# EAGLE schematic mainboardv3.1-clone (EAGLE 9.4.2)
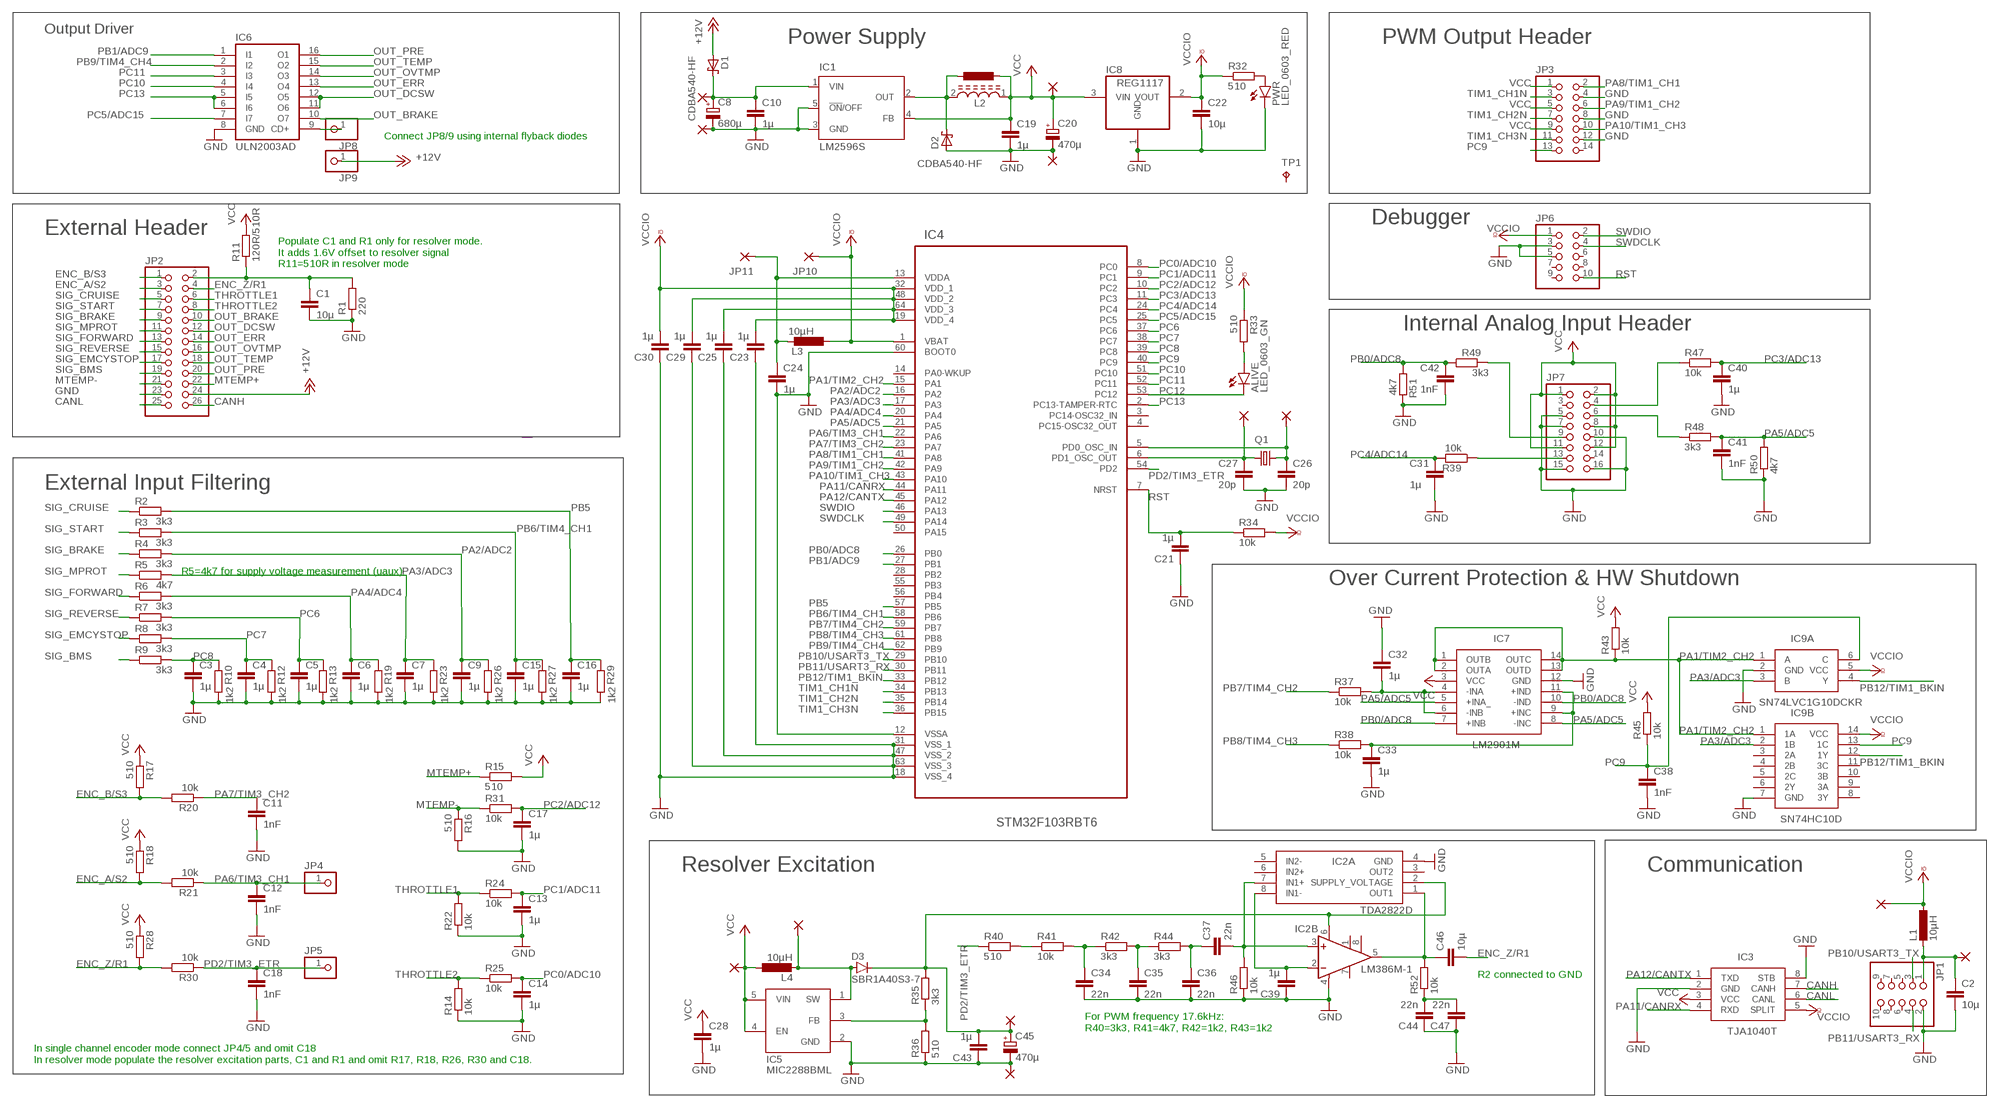
[diagram p0: schematic, sheet 1]

## Parts
ALIVE  LED_0603_GN  LEDSML0805  [SML0805]
C1  10µ  C-EUC0805K  [C0805K]
C2  10µ  C-EUC0805K  [C0805K]
C3  1µ  C-EUC0603K  [C0603K]
C4  1µ  C-EUC0603K  [C0603K]
C5  1µ  C-EUC0603K  [C0603K]
C6  1µ  C-EUC0603K  [C0603K]
C7  1µ  C-EUC0603K  [C0603K]
C8  680µ  CPOL-EU153CLV-1014  [153CLV-1014]
C9  1µ  C-EUC0603K  [C0603K]
C10  1µ  C-EUC0603K  [C0603K]
C11  1nF  C-EUC0603K  [C0603K]
C12  1nF  C-EUC0603K  [C0603K]
C13  1µ  C-EUC0603K  [C0603K]
C14  1µ  C-EUC0603K  [C0603K]
C15  1µ  C-EUC0603K  [C0603K]
C16  1µ  C-EUC0603K  [C0603K]
C17  1µ  C-EUC0603K  [C0603K]
C18  1nF  C-EUC0603K  [C0603K]
C19  1µ  C-EUC0603K  [C0603K]
C20  470µ  CPOL-EU153CLV-0605  [153CLV-0605]
C21  1µ  C-EUC0603K  [C0603K]
C22  10µ  C-EUC0805K  [C0805K]
C23  1µ  C-EUC0603K  [C0603K]
C24  1µ  C-EUC0603K  [C0603K]
C25  1µ  C-EUC0603K  [C0603K]
C26  20p  C-EUC0603K  [C0603K]
C27  20p  C-EUC0603K  [C0603K]
C28  1µ  C-EUC0603K  [C0603K]
C29  1µ  C-EUC0603K  [C0603K]
C30  1µ  C-EUC0603K  [C0603K]
C31  1µ  C-EUC0603K  [C0603K]
C32  1µ  C-EUC0603K  [C0603K]
C33  1µ  C-EUC0603K  [C0603K]
C34  22n  C-EUC0603K  [C0603K]
C35  22n  C-EUC0603K  [C0603K]
C36  22n  C-EUC0603K  [C0603K]
C37  22n  C-EUC0603K  [C0603K]
C38  1nF  C-EUC0603K  [C0603K]
C39  1µ  C-EUC0603K  [C0603K]
C40  1µ  C-EUC0603K  [C0603K]
C41  1nF  C-EUC0603K  [C0603K]
C42  1nF  C-EUC0603K  [C0603K]
C43  1µ  C-EUC0603K  [C0603K]
C44  22n  C-EUC0603K  [C0603K]
C45  470µ  CPOL-EU153CLV-0605  [153CLV-0605]
C46  10µ  C-EUC0805K  [C0805K]
C47  22n  C-EUC0603K  [C0603K]
D1  CDBA540-HF  SCHOTTKY-DIODESMD  [SMB]
D2  CDBA540-HF  SCHOTTKY-DIODESMD  [SMB]
D3  SBR1A40S3-7  D-SOD123  [SOD123]
IC1  LM2596S  [TO263-5]
IC2A  TDA2822D  [SOIC127P600X175-8N]
IC2B  LM386M-1  [SO08]
IC3  TJA1040T  [SOIC127P600X175-8N]
IC4  STM32F103RBT6  [QFP50P1200X1200X160-64N]
IC5  MIC2288BML  [SOT23-5L]
IC6  ULN2003AD  [SO16]
IC7  LM2901M  [SOP127P600X180-14N]
IC8  REG1117  [SOT223]
IC9A  SN74LVC1G10DCKR  [SOT65P210X110-6N]
IC9B  SN74HC10D  [SOIC127P600X175-14N]
JP1  PINHD-2X5/90  [2X05/90]
JP2  PINHD-2X13  [2X13]
JP3  PINHD-2X7  [2X07]
JP4  PINHD-1X1  [1X01]
JP5  PINHD-1X1  [1X01]
JP6  PINHD-2X5  [2X05]
JP7  PINHD-2X8  [2X08]
JP8  PINHD-1X1  [1X01]
JP9  PINHD-1X1  [1X01]
JP10  1,6/0,9  [1,6/0,9]
JP11  1,6/0,9  [1,6/0,9]
JP12  1,6/0,8  [1,6/0,8]
JP13  1,6/0,8  [1,6/0,8]
JP14  1,6/0,8  [1,6/0,8]
JP15  1,6/0,8  [1,6/0,8]
JP16  1,6/0,8  [1,6/0,8]
JP17  1,6/0,8  [1,6/0,8]
L1  10µH  L-EUL3225M  [L3225M]
L2  SRR1260-471K  [INDP125125X600N]
L3  10µH  L-EUL3225M  [L3225M]
L4  10µH  L-EUL3225M  [L3225M]
L5  L-EUTJ3-U1  [TJ3-U1]
PAD1  1,6/0,9  [1,6/0,9]
PAD2  1,6/0,9  [1,6/0,9]
PAD3  1,6/0,8  [1,6/0,8]
PAD4  1,6/0,8  [1,6/0,8]
PAD5  1,6/0,8  [1,6/0,8]
PAD6  1,6/0,8  [1,6/0,8]
PWR  LED_0603_RED  LEDSML0805  [SML0805]
Q1  CSM-7X-DU  [CSM-7X-DU]
R1  220  R-EU_R0603  [R0603]
R2  3k3  R-EU_R0603  [R0603]
R3  3k3  R-EU_R0603  [R0603]
R4  3k3  R-EU_R0603  [R0603]
R5  4k7  R-EU_R0603  [R0603]
R6  3k3  R-EU_R0603  [R0603]
R7  3k3  R-EU_R0603  [R0603]
R8  3k3  R-EU_R0603  [R0603]
R9  3k3  R-EU_R0603  [R0603]
R10  1k2  R-EU_R0603  [R0603]
R11  120R/510R  R-EU_R0603  [R0603]
R12  1k2  R-EU_R0603  [R0603]
R13  1k2  R-EU_R0603  [R0603]
R14  10k  R-EU_R0603  [R0603]
R15  510  R-EU_R0603  [R0603]
R16  510  R-EU_R0603  [R0603]
R17  510  R-EU_R0603  [R0603]
R18  510  R-EU_R0603  [R0603]
R19  1k2  R-EU_R0603  [R0603]
R20  10k  R-EU_R0603  [R0603]
R21  10k  R-EU_R0603  [R0603]
R22  10k  R-EU_R0603  [R0603]
R23  1k2  R-EU_R0603  [R0603]
R24  10k  R-EU_R0603  [R0603]
R25  10k  R-EU_R0603  [R0603]
R26  1k2  R-EU_R0603  [R0603]
R27  1k2  R-EU_R0603  [R0603]
R28  510  R-EU_R0603  [R0603]
R29  1k2  R-EU_R0603  [R0603]
R30  10k  R-EU_R0603  [R0603]
R31  10k  R-EU_R0603  [R0603]
R32  510  R-EU_R0603  [R0603]
R33  510  R-EU_R0603  [R0603]
R34  10k  R-EU_R0603  [R0603]
R35  3k3  R-EU_R0603  [R0603]
R36  510  R-EU_R0603  [R0603]
R37  10k  R-EU_R0603  [R0603]
R38  10k  R-EU_R0603  [R0603]
R39  10k  R-EU_R0603  [R0603]
R40  510  R-EU_R0603  [R0603]
R41  10k  R-EU_R0603  [R0603]
R42  3k3  R-EU_R0603  [R0603]
R43  10k  R-EU_R0603  [R0603]
R44  3k3  R-EU_R0603  [R0603]
R45  10k  R-EU_R0603  [R0603]
R46  10k  R-EU_R0603  [R0603]
R47  10k  R-EU_R0603  [R0603]
R48  3k3  R-EU_R0603  [R0603]
R49  3k3  R-EU_R0603  [R0603]
R50  4k7  R-EU_R0603  [R0603]
R51  4k7  R-EU_R0603  [R0603]
R52  10k  R-EU_R0603  [R0603]
TP1  TPB1,27  [B1,27]

## Nets
+12V: D1.A JP2.24 JP9.1
CANH: IC3.7(CANH) JP2.26
CANL: IC3.6(CANL) JP2.25
ENC_A/S2: JP2.3 R18.2 R21.2
ENC_B/S3: JP2.1 R17.2 R20.2
ENC_Z/R1: C46.2 JP2.4 R28.2 R30.2
GND: C1.2 C2.2 C3.2 C4.2 C5.2 C6.2 C7.2 C8.- C9.2 C10.2 C11.2 C12.2 C13.2 C14.2 C15.2 C16.2 C17.2 C18.2 C19.2 C20.- C21.1 C22.2 C23.1 C24.2 C25.1 C26.2 C27.2 C28.2 C29.1 C30.1 C31.2 C32.1 C33.2 C34.2 C35.2 C36.2 C38.2 C39.1 C40.2 C41.2 C42.2 C43.1 C44.1 C45.- C47.1 D2.A IC1.3(GND) IC1.5(!ON!/OFF) IC2A.4(GND) IC2B.4(GND) IC3.2(GND) IC3.8(STB) IC4.12(VSSA) IC4.18(VSS_4) IC4.31(VSS_1) IC4.47(VSS_2) IC4.60(BOOT0) IC4.63(VSS_3) IC5.2(GND) IC6.8(GND) IC7.12(GND) IC8.1(GND) IC9A.2(GND) IC9B.7(GND) JP1.2 JP2.23 JP3.4 JP3.8 JP3.12 JP6.3 JP6.5 JP7.5 JP7.7 JP7.10 JP7.15 JP7.16 PAD1.1(P) PAD3.1(P) PAD6.1(P) PWR.C R1.1 R10.2 R12.2 R13.2 R14.1 R16.2 R19.2 R22.1 R23.2 R26.2 R27.2 R29.2 R36.1 R46.1 R50.1 R51.2
MTEMP+: JP2.22 R15.1
MTEMP-: JP2.21 R16.1 R31.1
N$1: C1.1 JP2.2 R1.2 R11.1
N$2: ALIVE.A R33.2
N$3: D2.C IC1.2(OUT) L2.2 L5.1
N$4: C8.+ C10.1 D1.C IC1.1(VIN) PAD2.1(P)
N$5: PWR.A R32.2
N$7: C27.1 IC4.6(PD1_OSC_OUT) JP17.1(P) Q1.1
N$8: C24.1 IC4.13(VDDA) JP11.1(P) L3.1
N$9: IC6.9(CD+) JP8.1
N$10: JP7.9 R49.2
N$11: JP7.13 R39.1
N$12: JP7.4 R47.1
N$13: JP7.6 R48.1
N$14: C32.2 IC7.4(-INA) IC7.6(-INB) R37.2
N$15: C33.1 IC7.9(+INC) IC7.11(+IND) R38.2
N$16: D3.2(A) IC5.1(SW) JP13.1(P) L4.2
N$17: IC5.3(FB) R35.1 R36.2
N$18: C43.2 C45.+ D3.1(C) IC2A.2(SUPPLY_VOLTAGE) IC2B.6(VS) PAD5.1(P) R35.2
N$19: R40.2 R41.1
N$20: C34.1 R41.2 R42.1
N$21: C35.1 R42.2 R44.1
N$22: C36.1 C37.1 R44.2
N$23: C39.2 IC2A.8(IN1-) IC2B.2(-IN)
N$24: C37.2 IC2A.7(IN1+) IC2B.3(+IN) R46.2
N$25: C44.2 C47.2 R52.1
N$26: C46.1 IC2A.1(OUT1) IC2B.5(OUT) R52.2
N$27: C2.1 JP1.1 JP15.1(P) L1.2
N$28: C26.1 IC4.5(PD0_OSC_IN) JP16.1(P) Q1.2
OUT_BRAKE: IC6.10(O7) JP2.10
OUT_DCSW: IC6.11(O6) IC6.12(O5) JP2.12
OUT_ERR: IC6.13(O4) JP2.14
OUT_OVTMP: IC6.14(O3) JP2.16
OUT_PRE: IC6.16(O1) JP2.20
OUT_TEMP: IC6.15(O2) JP2.18
PA1/TIM2_CH2: IC4.15(PA1) IC7.1(OUTB) IC7.2(OUTA) IC7.13(OUTD) IC7.14(OUTC) IC9A.1(A) IC9B.1(1A) R43.1
PA2/ADC2: C9.1 IC4.16(PA2) R4.2 R26.1
PA3/ADC3: C7.1 IC4.17(PA3) IC9A.3(B) IC9B.2(1B) R5.2 R23.1
PA4/ADC4: C6.1 IC4.20(PA4) R6.2 R19.1
PA5/ADC5: C41.1 IC4.21(PA5) IC7.5(+INA_) IC7.8(-INC) R48.2 R50.2
PA6/TIM3_CH1: C12.1 IC4.22(PA6) JP4.1 R21.1
PA7/TIM3_CH2: C11.1 IC4.23(PA7) R20.1
PA8/TIM1_CH1: IC4.41(PA8) JP3.2
PA9/TIM1_CH2: IC4.42(PA9) JP3.6
PA10/TIM1_CH3: IC4.43(PA10) JP3.10
PA11/CANRX: IC3.4(RXD) IC4.44(PA11)
PA12/CANTX: IC3.1(TXD) IC4.45(PA12)
PB0/ADC8: C42.1 IC4.26(PB0) IC7.7(+INB) IC7.10(-IND) R49.1 R51.1
PB1/ADC9: IC4.27(PB1) IC6.1(I1)
PB5: C16.1 IC4.57(PB5) R2.2 R29.1
PB6/TIM4_CH1: C15.1 IC4.58(PB6) R3.2 R27.1
PB7/TIM4_CH2: IC4.59(PB7) R37.1
PB8/TIM4_CH3: IC4.61(PB8) R38.1
PB9/TIM4_CH4: IC4.62(PB9) IC6.2(I2)
PB10/USART3_TX: IC4.29(PB10) JP1.3
PB11/USART3_RX: IC4.30(PB11) JP1.4
PB12/TIM1_BKIN: IC4.33(PB12) IC9A.4(Y) IC9B.12(1Y)
PC0/ADC10: C14.1 IC4.8(PC0) R25.2
PC1/ADC11: C13.1 IC4.9(PC1) R24.2
PC2/ADC12: C17.1 IC4.10(PC2) R31.2
PC3/ADC13: C40.1 IC4.11(PC3) R47.2
PC4/ADC14: C31.1 IC4.24(PC4) R39.2
PC5/ADC15: IC4.25(PC5) IC6.7(I7)
PC6: C5.1 IC4.37(PC6) R7.2 R13.1
PC7: C4.1 IC4.38(PC7) R8.2 R12.1
PC8: C3.1 IC4.39(PC8) R9.2 R10.1
PC9: C38.1 IC4.40(PC9) IC9A.6(C) IC9B.13(1C) JP3.13 R45.1
PC10: IC4.51(PC10) IC6.4(I4)
PC11: IC4.52(PC11) IC6.3(I3)
PC12: ALIVE.C IC4.53(PC12)
PC13: IC4.2(PC13-TAMPER-RTC) IC6.5(I5) IC6.6(I6)
PD2/TIM3_ETR: C18.1 IC4.54(PD2) JP5.1 R30.1 R40.1
RST: C21.2 IC4.7(NRST) JP6.10 R34.1
SIG_BMS: JP2.19 R9.1
SIG_BRAKE: JP2.9 R4.1
SIG_CRUISE: JP2.5 R2.1
SIG_EMCYSTOP: JP2.17 R8.1
SIG_FORWARD: JP2.13 R6.1
SIG_MPROT: JP2.11 R5.1
SIG_REVERSE: JP2.15 R7.1
SIG_START: JP2.7 R3.1
SWDCLK: IC4.49(PA14) JP6.4
SWDIO: IC4.46(PA13) JP6.2
THROTTLE1: JP2.6 R22.2 R24.1
THROTTLE2: JP2.8 R14.2 R25.1
TIM1_CH1N: IC4.34(PB13) JP3.3
TIM1_CH2N: IC4.35(PB14) JP3.7
TIM1_CH3N: IC4.36(PB15) JP3.11
VCC: C19.1 C20.+ C28.1 IC1.4(FB) IC3.3(VCC) IC5.4(EN) IC5.5(VIN) IC7.3(VCC) IC8.3(VIN) JP3.1 JP3.5 JP3.9 JP7.1 JP7.2 JP7.8 JP7.11 JP7.12 JP12.1(P) L2.1 L4.1 L5.2 PAD4.1(P) R11.2 R15.2 R17.1 R18.1 R28.1 R43.2 R45.2
VCCIO: C22.1 C23.2 C25.2 C29.2 C30.2 IC3.5(SPLIT) IC4.1(VBAT) IC4.19(VDD_4) IC4.32(VDD_1) IC4.48(VDD_2) IC4.64(VDD_3) IC8.2(VOUT) IC9A.5(VCC) IC9B.14(VCC) JP6.1 JP10.1(P) JP14.1(P) L1.1 L3.2 R32.1 R33.1 R34.2
Unconnected: IC2A.3(OUT2) IC2A.5(IN2-) IC2A.6(IN2+) IC2B.1(GAIN) IC2B.7(BYPASS) IC2B.8(GAIN) IC4.3(PC14-OSC32_IN) IC4.4(PC15-OSC32_OUT) IC4.14(PA0-WKUP) IC4.28(PB2) IC4.50(PA15) IC4.55(PB3) IC4.56(PB4) IC9B.3(2A) IC9B.4(2B) IC9B.5(2C) IC9B.6(2Y) IC9B.8(3Y) IC9B.9(3A) IC9B.10(3B) IC9B.11(3C) JP1.5 JP1.6 JP1.7 JP1.8 JP1.9 JP1.10 JP3.14 JP6.6 JP6.7 JP6.8 JP6.9 JP7.3 JP7.14 TP1.TP

## Notes on the sheet
- Output Driver
- Power Supply | PWM Output Header
- Connect JP8/9 using internal flyback diodes
- Debugger
- External Header
- Populate C1 and R1 only for resolver mode.
  It adds 1.6V offset to resolver signal
  R11=510R in resolver mode
- Internal Analog Input Header
- External Input Filtering
- R5=4k7 for supply voltage measurement (uaux)
- Over Current Protection & HW Shutdown
- Resolver Excitation | Communication
- R2 connected to GND
- For PWM frequency 17.6kHz:
  R40=3k3, R41=4k7, R42=1k2, R43=1k2
- In single channel encoder mode connect JP4/5 and omit C18
  In resolver mode populate the resolver excitation parts, C1 and R1 and omit R17, R18, R26, R30 and C18.

## Library data of the parts
ALIVE PWR = led:LED: LED OSRAM: - CHIPLED LG R971, LG N971, LY N971, LG Q971, LY Q971, LO R971, LY R971 LH N974, LH R974 LS Q976, LO Q976, LY Q976 LO Q996 - Hyper CHIPLED LW Q18S LB Q993, LB Q99A, LB R99A - SideLED LS A670, LO A670, LY A670, LG A670, LP A670 LB A673, LV A673, LT A673, LW A673 LH A674 LY A675 LS A676, LA A676, LO A676, LY A676, LW A676 LS A679, LY A679, LG A679 - Hyper Micro SIDELED® LS Y876, LA Y876, LO Y876, LY Y876 LT Y87S - SmartLED LW L88C, LW L88S LB L89C, LB L89S, LG L890 LS L89K, LO L89K, LY L89K LS L896, LA L896, LO L896, LY L896 - TOPLED LS T670, LO T670, LY T670, LG T670, LP T670 LSG T670, LSP T670, LSY T670, LOP T670, LYG T670 LG T671, LOG T671, LSG T671 LB T673, LV T673, LT T673, LW T673 LH T674 LS T676, LA T676, LO T676, LY T676, LB T676, LH T676, LSB T676, LW T676 LB T67C, LV T67C, LT T67C, LS T67K, LO T67K, LY T67K, LW E67C LS E67B, LA E67B, LO E67B, LY E67B, LB E67C, LV E67C, LT E67C LW T67C LS T679, LY T679, LG T679 LS T770, LO T770, LY T770, LG T770, LP T770 LB T773, LV T773, LT T773, LW T773 LH T774 LS E675, LA E675, LY E675, LS T675 LS T776, LA T776, LO T776, LY T776, LB T776 LHGB T686 LT T68C, LB T68C - Hyper Mini TOPLED® LB M676 - Mini TOPLED Santana® LG M470 LS M47K, LO M47K, LY M47K Source: http://www.osram.convergy.de LUXEON: - LUMILED® LXK2-PW12-R00, LXK2-PW12-S00, LXK2-PW14-U00, LXK2-PW14-V00 LXK2-PM12-R00, LXK2-PM12-S00, LXK2-PM14-U00 LXK2-PE12-Q00, LXK2-PE12-R00, LXK2-PE12-S00, LXK2-PE14-T00, LXK2-PE14-U00 LXK2-PB12-K00, LXK2-PB12-L00, LXK2-PB12-M00, LXK2-PB14-N00, LXK2-PB14-P00, LXK2-PB14-Q00 LXK2-PR12-L00, LXK2-PR12-M00, LXK2-PR14-Q00, LXK2-PR14-R00 LXK2-PD12-Q00, LXK2-PD12-R00, LXK2-PD12-S00 LXK2-PH12-R00, LXK2-PH12-S00 LXK2-PL12-P00, LXK2-PL12-Q00, LXK2-PL12-R00 Source: www.luxeon.com KINGBRIGHT: KA-3528ASYC Source: www.kingbright.com
C1-C7 C9-C19 C21-C44 C46 C47 = resistor:C-EU: CAPACITOR, European symbol
C8 C20 C45 = resistor:CPOL-EU: POLARIZED CAPACITOR, European symbol
D1 D2 = diode:SCHOTTKY-DIODE: Schottky Diode
D3 = semicon-smd-ipc:D-: DIODE unfilled
IC1 = national-semiconductor:LM2596: SIMPLE SWITCHER® Power Converter 150 kHz 3A Step-Down Voltage Regulator Source: http://www.national.com/ds/LM/LM2596.pdf; MF: NATIONAL SEMICONDUCTOR; MPN: LM2596S-ADJ/NOPB; OC_FARNELL: 9494367; OC_NEWARK: 41K3842
IC2A = SamacSys_Parts:TDA2822D: Quadmm TDA2822D, Audio Amplifier Class-AB mono/stereo +150C 8-Pin SOIC Source: Datasheet <http://docs-emea.rs-online.com/webdocs/0acf/0900766b80acf19c.pdf>; ALLIED_NUMBER: 70391772; ALLIED_PRICE-STOCK: http://www.alliedelec.com/stmicroelectronics-tda2822d/70391772/; DESCRIPTION: Quadmm TDA2822D, Audio Amplifier Class-AB mono/stereo +150C 8-Pin SOIC; HEIGHT: 1.75mm; MANUFACTURER_NAME: STMicroelectronics; MANUFACTURER_PART_NUMBER: TDA2822D; MOUSER_PART_NUMBER: 511-TDA2822D; MOUSER_PRICE-STOCK: https://www.mouser.com/Search/Refine.aspx?Keyword=511-TDA2822D; RS_PART_NUMBER: 0426162P; RS_PRICE-STOCK: http://uk.rs-online.com/web/p/products/0426162P
IC2B = linear:LM386?-*: Low Voltage Audio Power Amplifier Source: http://cache.national.com/ds/LM/LM386.pdf
IC3 = SamacSys_Parts:TJA1040T: NXP TJA1040T, CAN Transceiver 1MBd 1-channel ISO 11898, 8-Pin SOIC Source: Datasheet <https://docs-emea.rs-online.com/webdocs/0425/0900766b804252fe.pdf>; DESCRIPTION: NXP TJA1040T, CAN Transceiver 1MBd 1-channel ISO 11898, 8-Pin SOIC; HEIGHT: 1.75mm; MANUFACTURER_NAME: NXP; MANUFACTURER_PART_NUMBER: TJA1040T; MOUSER_PART_NUMBER: 4837547; MOUSER_PRICE-STOCK: http://uk.rs-online.com/web/p/products/4837547; RS_PART_NUMBER: 4837547; RS_PRICE-STOCK: http://uk.rs-online.com/web/p/products/4837547
IC4 = STM32F103RBT6:STM32F103RBT6: 32BIT MCU; DESCRIPTION: Mainstream Performance line, ARM Cortex-M3 MCU with 128 Kbytes Flash, 72 MHz CPU, motor control, USB and CAN; DIGI-KEY_PART_NUMBER: 497-6066-ND; DIGI-KEY_PURCHASE_URL: https://www.digikey.ca/product-detail/en/stmicroelectronics/STM32F103RBT6/497-6066-ND/1646341?utm_source=snapeda&utm_medium=aggregator&utm_campaign=symbol; MF: STMicroelectronics; MP: STM32F103RBT6; PACKAGE: LQFP-64 STMicroelectronics
IC5 = MIC2288:MIC2288BML: Boost 3V-4.2V input to adjustable output (Micrel)
IC6 = uln-udn:ULN2003A: DRIVER ARRAY
IC7 = SamacSys_Parts:LM2901M: IC COMPARATOR QUAD VOLT Source: Datasheet <http://www.ti.com/lit/ds/symlink/lm2901-n.pdf>; DESCRIPTION: IC COMPARATOR QUAD VOLT; HEIGHT: mm; MANUFACTURER_NAME: National Semiconductor; MANUFACTURER_PART_NUMBER: LM2901M; MOUSER_PART_NUMBER: 4716204; MOUSER_PRICE-STOCK: http://uk.rs-online.com/web/p/products/4716204; RS_PART_NUMBER: 4716204; RS_PRICE-STOCK: http://uk.rs-online.com/web/p/products/4716204
IC8 = burr-brown:REG1117: 800mA and 1A Low Dropout (LDO) Positive Regulator 1.8V, 2.5V, 2.85V, 3.3V, 5V, and Adj; MPN: REG1117; OC_FARNELL: 1097566; OC_NEWARK: 14P6981
IC9A = SamacSys_Parts:SN74LVC1G10DCKR: Texas Instruments SN74LVC1G10DCKR, NAND 3 Input NAND, 1.65 5.5 V, 6-Pin SC-70 Source: Datasheet <http://www.ti.com/general/docs/lit/getliterature.tsp?genericPartNumber=SN74LVC1G10&&fileType=pdf>; DESCRIPTION: Texas Instruments SN74LVC1G10DCKR, NAND 3 Input NAND, 1.65 5.5 V, 6-Pin SC-70; HEIGHT: 1.1mm; MANUFACTURER_NAME: Texas Instruments; MANUFACTURER_PART_NUMBER: SN74LVC1G10DCKR; MOUSER_PART_NUMBER: 595-SN74LVC1G10DCKR; MOUSER_PRICE-STOCK: https://www.mouser.com/Search/Refine.aspx?Keyword=595-SN74LVC1G10DCKR; RS_PART_NUMBER: 1627462; RS_PRICE-STOCK: http://uk.rs-online.com/web/p/products/1627462
IC9B = SamacSys_Parts:SN74HC10D: Triple 3-Input Positive-NAND Gates Source: Datasheet <http://www.ti.com/lit/ds/symlink/sn74hc10.pdf>; DESCRIPTION: Triple 3-Input Positive-NAND Gates; HEIGHT: 1.75mm; MANUFACTURER_NAME: Texas Instruments; MANUFACTURER_PART_NUMBER: SN74HC10D; MOUSER_PART_NUMBER: 595-SN74HC10D; MOUSER_PRICE-STOCK: https://www.mouser.com/Search/Refine.aspx?Keyword=595-SN74HC10D; RS_PART_NUMBER: 6631896P; RS_PRICE-STOCK: http://uk.rs-online.com/web/p/products/6631896P
JP1 JP6 = pinhead:PINHD-2X5: PIN HEADER
JP2 = pinhead:PINHD-2X13: PIN HEADER
JP3 = pinhead:PINHD-2X7: PIN HEADER
JP4 JP5 JP8 JP9 = pinhead:PINHD-1X1: PIN HEADER
JP7 = pinhead:PINHD-2X8: PIN HEADER
JP10 JP11 PAD1 PAD2 = wirepad:1,6/0,9: THROUGH-HOLE PAD
JP12-JP17 PAD3-PAD6 = wirepad:1,6/0,8: THROUGH-HOLE PAD
L1 L3 L4 = rcl:L-EU: INDUCTOR, European symbol; SPICEPREFIX: L
L2 = SRR1260-471K:SRR1260-471K: Inductor Power Shielded Wirewound 33uH 20% 100KHz 27Q-Factor Ferrite 3A 60mOhm DCR T/R; AVAILABILITY: Unavailable; DESCRIPTION: Inductor Power Shielded Wirewound 470uH 10% 100KHz 18Q-Factor Ferrite 950mA 820mOhm DCR T/R; MF: Bourns; MP: SRR1260-471K; PACKAGE: Nonstandard Bourns; PRICE: None
L5 = resistor:L-EU: INDUCTOR, European symbol
Q1 = crystal:CSM-7X-DU: SMD CRYSTAL Source: www.ecsxtal.com .. Crystal 3.6864MHz CSM_7X_DU.PDF; OC_FARNELL: unknown; OC_NEWARK: unknown
R1-R52 = rcl:R-EU_: RESISTOR, European symbol; SPICEPREFIX: R
TP1 = testpad:TP: Test pad